# Altium schematic sheet MCU.SchDoc
size 381 x 241 mm; SheetNumber: 2; SheetTotal: 2
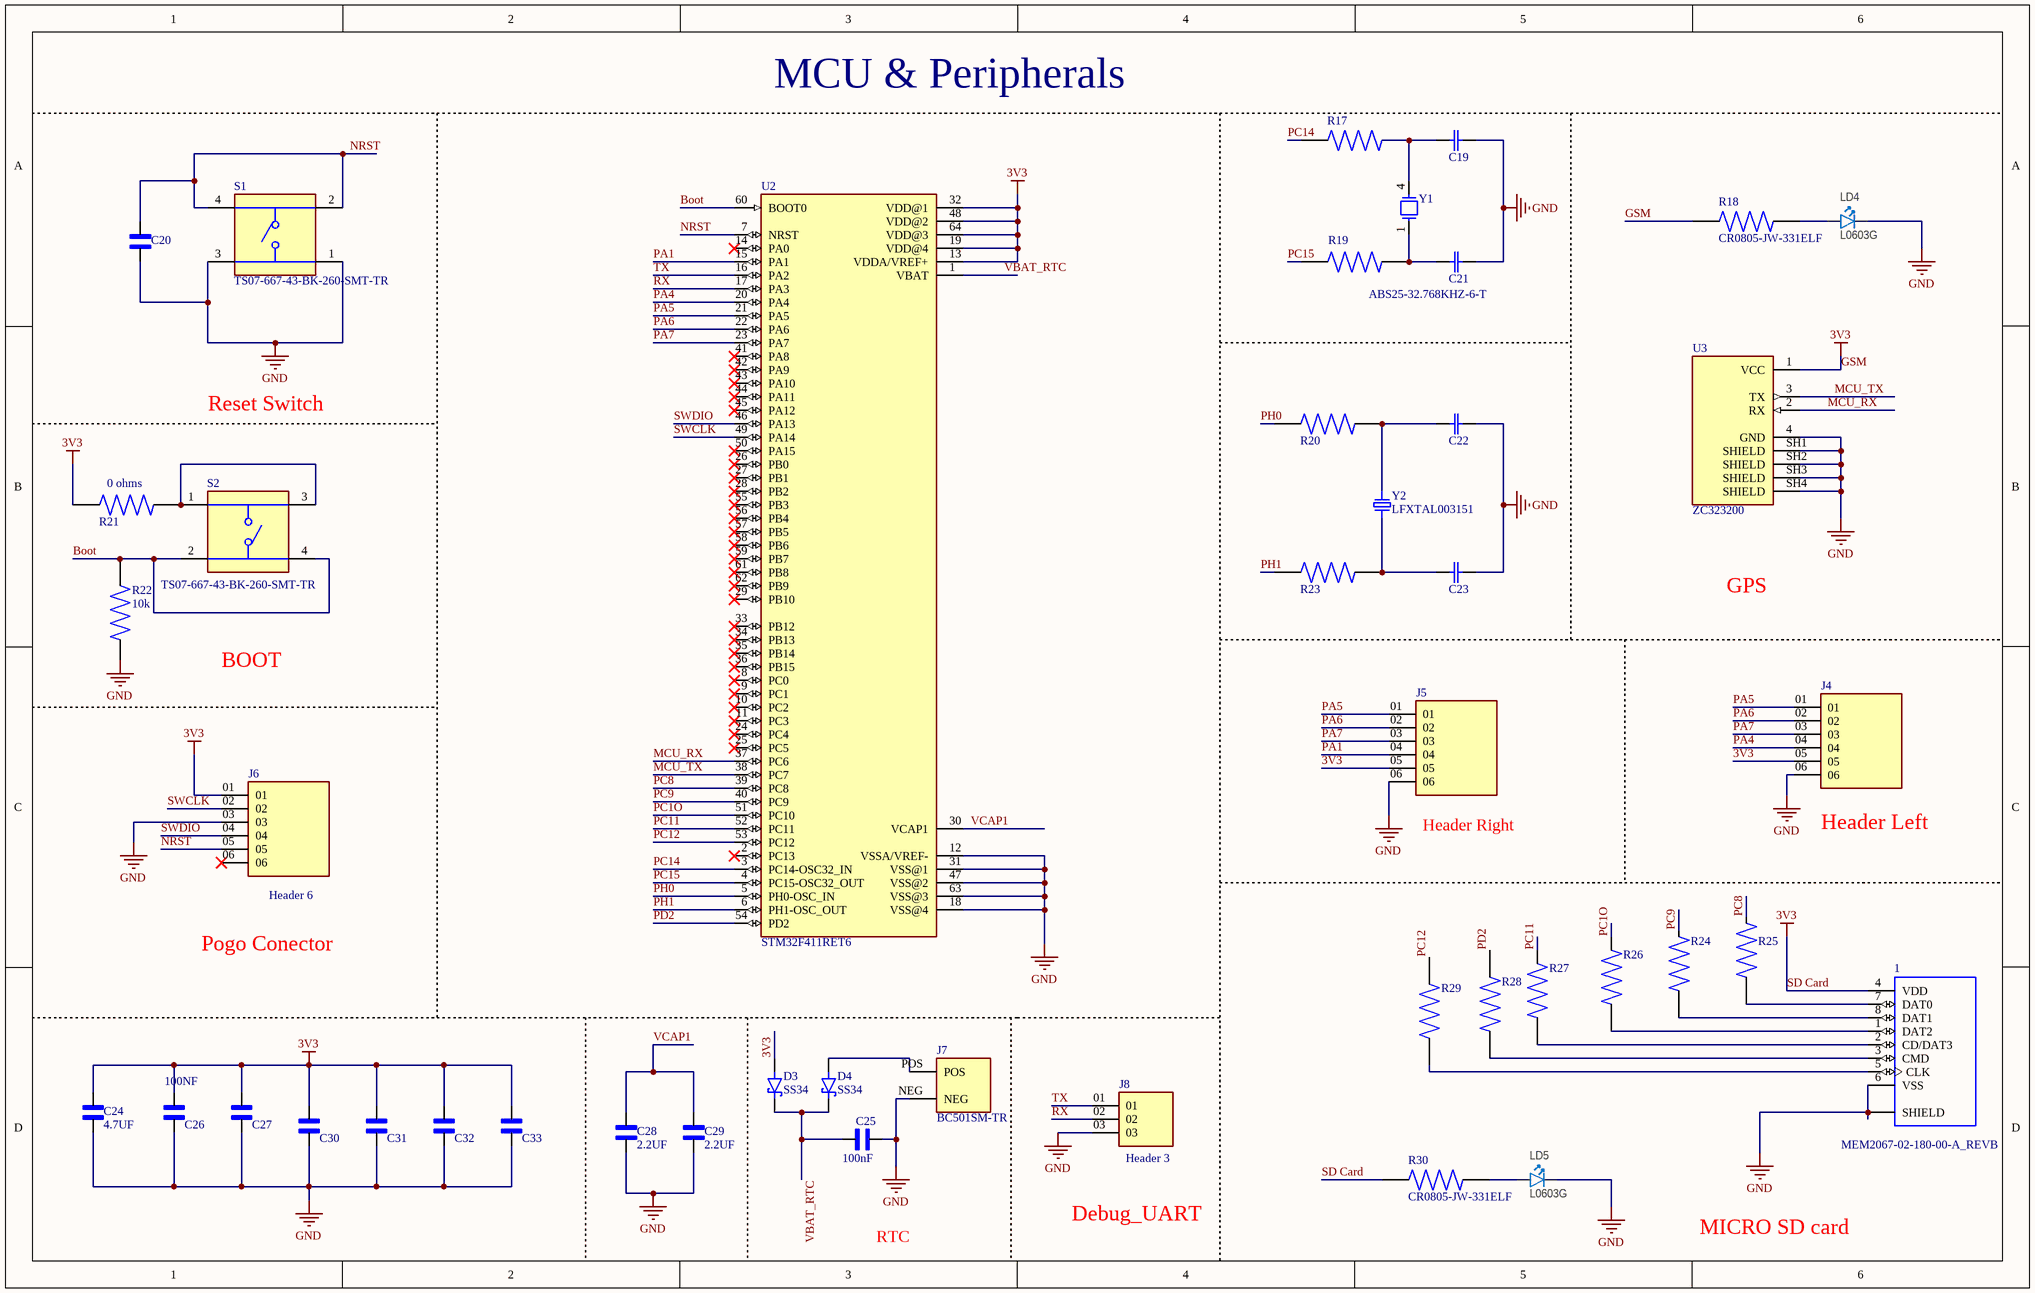
[diagram p0: MCU.SchDoc]

## Parts
1  MEM2067-02-180-00-A_REVB  [GCT_MEM2067-02-180-00-A_REVB]
C19  C0603C200J5GACTU  [CAPC1608X85N]  (value not drawn)
C20  C0603C104J3RACTU  [CAPC1608X90]  (value not drawn)
C21  C0603C200J5GACTU  [CAPC1608X85N]  (value not drawn)
C22  C0603C200J5GACTU  [CAPC1608X85N]  (value not drawn)
C23  C0603C200J5GACTU  [CAPC1608X85N]  (value not drawn)
C24  4.7UF  [CAPC2012X135N]
C25  100nF  [CAPC1608X90]
C26  100NF  [CAPC1608X90]
C27  C0603C104J3RACTU  [CAPC1608X90]  (value not drawn)
C28  2.2UF  [CAPC2012X135N]
C29  2.2UF  [CAPC2012X135N]
C30  C0603C104J3RACTU  [CAPC1608X90]  (value not drawn)
C31  C0603C104J3RACTU  [CAPC1608X90]  (value not drawn)
C32  C0603C104J3RACTU  [CAPC1608X90]  (value not drawn)
C33  C0603C104J3RACTU  [CAPC1608X90]  (value not drawn)
D3  SS34  [DIO_SS34]
D4  SS34  [DIO_SS34]
J4  Header Left  [SAMTEC_MTLW-106-06-G-S-180]
J5  Header Right  [SAMTEC_MTLW-106-06-G-S-180]
J6  Header 6  [SAMTEC_MTLW-106-06-G-S-180]
J7  BC501SM-TR  [MPD_BC501SM-TR]
J8  Header 3  [SAMTEC_HMTSW-103-XX-X-S-XXX]
LD4  L0603G  [LED_0603_G]
LD5  L0603G  [LED_0603_G]
R17  AC1206FR-070RL  [RESC3116X65N]  (value not drawn)
R18  CR0805-JW-331ELF  [RESC2012X60N]
R19  AC1206FR-070RL  [RESC3116X65N]  (value not drawn)
R20  AC1206FR-070RL  [RESC3116X65N]  (value not drawn)
R21  0 ohms  [RESC3116X65N]
R22  10k  [RESC2012X60N]
R23  AC1206FR-070RL  [RESC3116X65N]  (value not drawn)
R24  RC0805FR-0710KL  [RESC2012X60N]  (value not drawn)
R25  RC0805FR-0710KL  [RESC2012X60N]  (value not drawn)
R26  RC0805FR-0710KL  [RESC2012X60N]  (value not drawn)
R27  RC0805FR-0710KL  [RESC2012X60N]  (value not drawn)
R28  RC0805FR-0710KL  [RESC2012X60N]  (value not drawn)
R29  RC0805FR-0710KL  [RESC2012X60N]  (value not drawn)
R30  CR0805-JW-331ELF  [RESC2012X60N]
S1  TS07-667-43-BK-260-SMT-TR  [SW_TS07-667-43-BK-260-SMT-TR]
S2  TS07-667-43-BK-260-SMT-TR  [SW_TS07-667-43-BK-260-SMT-TR]
U2  STM32F411RET6  [QFP50P1200X1200X160-64N]
U3  ZC323200  [XCVR_ZC323200]
Y1  ABS25-32.768KHZ-6-T  [XTAL_ABS25-32.768KHZ-6-T]
Y2  LFXTAL003151  [WE-XTAL_HC49/4HSMX]

## Nets
3V3: 1.4(VDD) C24.1 C26.2 C27.2 C30.2 C31.2 C32.2 C33.2 D3.A J4.05 J5.05 J6.01 R18.1 R21.2 R30.1 U2.13(VDDA/VREF+) U2.19(VDD@4) U2.32(VDD@1) U2.48(VDD@2) U2.64(VDD@3) U3.1(VCC)  [also labelled GSM, SD Card]
GND: 1.6(VSS) 1.9(SHIELD) 1.10(SHIELD) 1.11(SHIELD) 1.12(SHIELD) C19.2(C2) C20.2 C21.1(C1) C22.1(C1) C23.2(C2) C24.2 C25.1 C26.1 C27.1 C28.2 C29.2 C30.1 C31.1 C32.1 C33.1 J4.06 J5.06 J6.03 J7.NEG J8.03 LD4.1(C) LD5.1(C) S1.1 S1.3 U2.12(VSSA/VREF-) U2.18(VSS@4) U2.31(VSS@1) U2.47(VSS@2) U2.63(VSS@3) U3.4(GND) U3.SH1(SHIELD) U3.SH2(SHIELD) U3.SH3(SHIELD) U3.SH4(SHIELD)
Boot: R22.2 S2.2 S2.4 U2.60(BOOT0)
MCU_RX: U2.37(PC6) U3.2(RX)
MCU_TX: U2.38(PC7) U3.3(TX)
NRST: C20.1 J6.05 S1.2 S1.4 U2.7(NRST)
PA1: J5.04 U2.15(PA1)
PA4: J4.04 U2.20(PA4)
PA5: J4.01 J5.01 U2.21(PA5)
PA6: J4.02 J5.02 U2.22(PA6)
PA7: J4.03 J5.03 U2.23(PA7)
PC1O: R26.2 U2.51(PC10)
PC8: R25.2 U2.39(PC8)
PC9: R24.2 U2.40(PC9)
PC11: R27.1 U2.52(PC11)
PC12: R29.2 U2.53(PC12)
PC14: R17.1 U2.3(PC14-OSC32_IN)
PC15: R19.1 U2.4(PC15-OSC32_OUT)
PD2: R28.2 U2.54(PD2)
PH0: R20.1 U2.5(PH0-OSC_IN)
PH1: R23.1 U2.6(PH1-OSC_OUT)
RX: J8.02 U2.17(PA3)
SWCLK: J6.02 U2.49(PA14)
SWDIO: J6.04 U2.46(PA13)
TX: J8.01 U2.16(PA2)
VBAT_RTC: C25.2 D3.C(K) D4.C(K) U2.1(VBAT)
VCAP1: C28.1 C29.1 U2.30(VCAP1)
Net1_1: 1.1(DAT2) R26.1
Net1_2: 1.2(CD/DAT3) R27.2
Net1_3: 1.3(CMD) R28.1
Net1_5: 1.5(CLK) R29.1
Net1_7: 1.7(DAT0) R25.1
Net1_8: 1.8(DAT1) R24.1
NetC19_1: C19.1(C1) R17.2 Y1.4
NetC21_2: C21.2(C2) R19.2 Y1.1
NetC22_2: C22.2(C2) R20.2 Y2.2
NetC23_1: C23.1(C1) R23.2 Y2.1
NetD4_A: D4.A J7.POS
NetLD4_2: LD4.2(A) R18.2
NetLD5_2: LD5.2(A) R30.2
NetR21_1: R21.1 S2.1 S2.3

Not connected (* = marked no-connect by the designer): J6 06*; R22 1; U2 2(PC13)* 8(PC0)* 9(PC1)* 10(PC2)* 11(PC3)* 14(PA0)* 24(PC4)* 25(PC5)* 26(PB0)* 27(PB1)* 28(PB2)* 29(PB10)* 33(PB12)* 34(PB13)* 35(PB14)* 36(PB15)* 41(PA8)* 42(PA9)* 43(PA10)* 44(PA11)* 45(PA12)* 50(PA15)* 55(PB3)* 56(PB4)* 57(PB5)* 58(PB6)* 59(PB7)* 61(PB8)* 62(PB9)*

## Notes on the sheet
- MCU & Peripherals
- Reset Switch
- GPS
- BOOT
- Pogo Conector
- RTC
- Debug_UART
- MICRO SD card
- Labels drawn without touching a wire or pin: GND

## Library data of the parts
1 = MEM2067-02-180-00-A_REVB: Micro SD Memory Card ConnectorSMT, Hinged, 1.80mm Profile; Price: None; Value: *; MP: MEM2067-02-180-00-A_REVB; Package: None; Availability: Unavailable
C19 C21-C23 = C0603C200J5GACTU: Capacitor Ceramic C0G 0603 50V 20pF | KEMET C0603C200J5GACTU; SnapEDA_Link: https://www.snapeda.com/parts/C0603C200J5GACTU/KEMET/view-part/?ref=snap; Package: 0603 Kemet; Value: *; MF: KEMET; MP: C0603C200J5GACTU; Check_prices: https://www.snapeda.com/parts/C0603C200J5GACTU/KEMET/view-part/?ref=eda
C20 C25-C27 C30-C33 = C0603C104J3RACTU: 0603 C 100nF Ceramic Multilayer Capacitor, 25 V, +125degC, X7R Dielectric, +/-5% | KEMET C0603C104J3RACTU; SnapEDA_Link: https://www.snapeda.com/parts/C0603C104J3RACTU/KEMET/view-part/?ref=snap; Package: 603-2 KEMET; Value: *; MF: KEMET; MP: C0603C104J3RACTU; Check_prices: https://www.snapeda.com/parts/C0603C104J3RACTU/KEMET/view-part/?ref=eda
C24 C28 C29 = CL21B225KPFNNNG: 2.2 ÂµF Â±10% 10V Ceramic Capacitor X7R 0805 (2012 Metric); MF: Samsung; SnapEDA_Link: https://www.snapeda.com/parts/CL21B225KPFNNNG/Samsung/view-part/?ref=snap; Package: SMD-2 Samsung; Value: *; MP: CL21B225KPFNNNG; Check_prices: https://www.snapeda.com/parts/CL21B225KPFNNNG/Samsung/view-part/?ref=eda
D3 D4 = SS34: 3A, 40V, Schottky Rectifier; MF: Taiwan Semiconductor; SnapEDA_Link: https://www.snapeda.com/parts/SS34/taiwan/view-part/?ref=snap; Package: DO-214AB-2 Taiwan Semiconductor; Value: *; MP: SS34; Check_prices: https://www.snapeda.com/parts/SS34/taiwan/view-part/?ref=eda
J4-J6 = MTLW-106-06-G-S-180: Package: None; MP: MTLW-106-06-G-S-180; Price: None; Availability: Unavailable; Value: *
J7 = BC501SM-TR: Battery Holder (Open) Coin, 12.0mm 1 Cell SMD (SMT) Tab; MF: MPD (Memory; SnapEDA_Link: https://www.snapeda.com/parts/BC501SM-TR/MPD/view-part/?ref=snap; Package: DFN-8 MPD; Value: *; MP: BC501SM-TR; Check_prices: https://www.snapeda.com/parts/BC501SM-TR/MPD/view-part/?ref=eda
J8 = HMTSW-103-XX-X-S-XXX: Connector Unshrouded Header 3 Position 2.54mm Solder Straight Through Hole; MF: Samtec; MP: HMTSW-103-10-T-S-330; SnapEDA_Link: https://www.snapeda.com/parts/HMTSW-103-10-T-S-330/Samtec/view-part/?ref=snap; Package: None; Value: *; Check_prices: https://www.snapeda.com/parts/HMTSW-103-10-T-S-330/Samtec/view-part/?ref=eda
LD4 LD5 = ASMT-RF45-AN002: LED, Yellow Green, 0603, Vf=2V, - 40 to +100°C; Manufacturer: Avago; Part number NEMS: 101400010; Component Status: Active; Pad Count: 2; Note: 28 mcd @ 20 mA; Artikkelnr Noca: N.A.; Part Number: ASMT-RF45-AN002; PartId: 101400010; Component Class: Optoelectronics; Author: rsk; Manufacturer Part Number: ASMT-RF45-AN002; ComponentLink1URL: N.A.; ComponentLink1Description: Datasheet; ComponentLink2URL: N.A.; ComponentLink2Description: Supplier link; HelpURL: http://www.avagotech.com/docs/AV02-0378EN; LatestRevisionDate: 2015-06-12; Published: 2015-06-12; Footprint Doc: 0603; Value: L0603G; Supplier 1: Digi-Key; Supplier Part Number 1: 516-2522-1-ND; Supplier 2: Mouser; Supplier Part Number 2: 630-ASMT-RF45-AN002; Part number IPS: N.A.; Part number Norautron: N.A.
R17 R19-R21 R23 = AC1206FR-070RL: 0 Ohms Jumper Chip Resistor 1206 (3216 Metric) Automotive AEC-Q200 Thick Film; MF: Yageo; SnapEDA_Link: https://www.snapeda.com/parts/AC1206FR-070RL/Yageo/view-part/?ref=snap; Package: SMD-2 Yageo; Value: *; MP: AC1206FR-070RL; Check_prices: https://www.snapeda.com/parts/AC1206FR-070RL/Yageo/view-part/?ref=eda
R18 R22 R30 = CR0805-JW-331ELF: Res 0805 330R 5% 125mW | Bourns CR0805-JW-331ELF; SnapEDA_Link: https://www.snapeda.com/parts/CR0805-JW-331ELF/Bourns/view-part/?ref=snap; Package: 0805 Bourns; Value: *; MF: Bourns; MP: CR0805-JW-331ELF; Check_prices: https://www.snapeda.com/parts/CR0805-JW-331ELF/Bourns/view-part/?ref=eda
R24-R29 = RC0805FR-0710KL: 10 kOhms Â±1% 0.125W, 1/8W Chip Resistor 0805 (2012 Metric) Moisture Resistant Thick Film; MF: Yageo; Value: *; SnapEDA_Link: https://www.snapeda.com/parts/RC0805FR-0710KL/Yageo/view-part/?ref=snap; Purchase-URL: https://pricing.snapeda.com/search/part/RC0805FR-0710KL/?ref=eda; Availability: In Stock; Price: None; Package: 2012 Rohm Semiconductor; Check_prices: https://www.snapeda.com/parts/RC0805FR-0710KL/Yageo/view-part/?ref=eda; MP: RC0805FR-0710KL
S1 S2 = TS07-667-43-BK-260-SMT-TR: 6 x 6.7 mm, 4.3 mm Actuator Height, 260 gf, Black, Surface Mount, SPST, Tactile Switch; MF: Same Sky; SnapEDA_Link: https://www.snapeda.com/parts/TS07-667-43-BK-260-SMT-TR/Same+Sky/view-part/?ref=snap; Package: None; Value: *; MP: TS07-667-43-BK-260-SMT-TR; Check_prices: https://www.snapeda.com/parts/TS07-667-43-BK-260-SMT-TR/Same+Sky/view-part/?ref=eda
U2 = STM32F411RET6: ARMÂ® CortexÂ®-M4 STM32F4 Mikrodenetleyici IC 32-Bit Tek Ã‡ekirdek 100MHz 512KB (512K x 8) FLASH 64-LQFP (10x10); MF: STMicroelectronics; SnapEDA_Link: https://www.snapeda.com/parts/STM32F411RET6/STMicroelectronics/view-part/?ref=snap; Package: LQFP-64 STMicroelectronics; Value: *; MP: STM32F411RET6; Check_prices: https://www.snapeda.com/parts/STM32F411RET6/STMicroelectronics/view-part/?ref=eda
U3 = ZC323200: GY-NEO6MV2 GY-GPS6MV2 NEO-6M GPS Module with Flight Control APM2.5; MF: YKS; SnapEDA_Link: https://www.snapeda.com/parts/ZC323200/YKS/view-part/?ref=snap; Package: None; Value: *; MP: ZC323200; Check_prices: https://www.snapeda.com/parts/ZC323200/YKS/view-part/?ref=eda
Y1 = ABS25-32.768KHZ-6-T: 32.768 kHz Â±20ppm Crystal 6pF 50 kOhms 4-SOJ, 5.50mm pitch; MF: Abracon; SnapEDA_Link: https://www.snapeda.com/parts/ABS25-32.768KHZ-6-T/Abracon/view-part/?ref=snap; Package: 4-4 Abracon; Value: *; MP: ABS25-32.768KHZ-6-T; Check_prices: https://www.snapeda.com/parts/ABS25-32.768KHZ-6-T/Abracon/view-part/?ref=eda
Y2 = LFXTAL003151: 8 MHz Â±30ppm Crystal 16pF 40 Ohms HC-49/US; MF: IQD Frequency Products; SnapEDA_Link: https://www.snapeda.com/parts/LFXTAL003151/IQD+Frequency+Products/view-part/?ref=snap; Package: HC-49/US IQD Frequency Products; Value: *; MP: LFXTAL003151; Check_prices: https://www.snapeda.com/parts/LFXTAL003151/IQD+Frequency+Products/view-part/?ref=eda